# Altium schematic sheet MainSchematic.SchDoc
size A; SheetNumber: 1; SheetTotal: 1
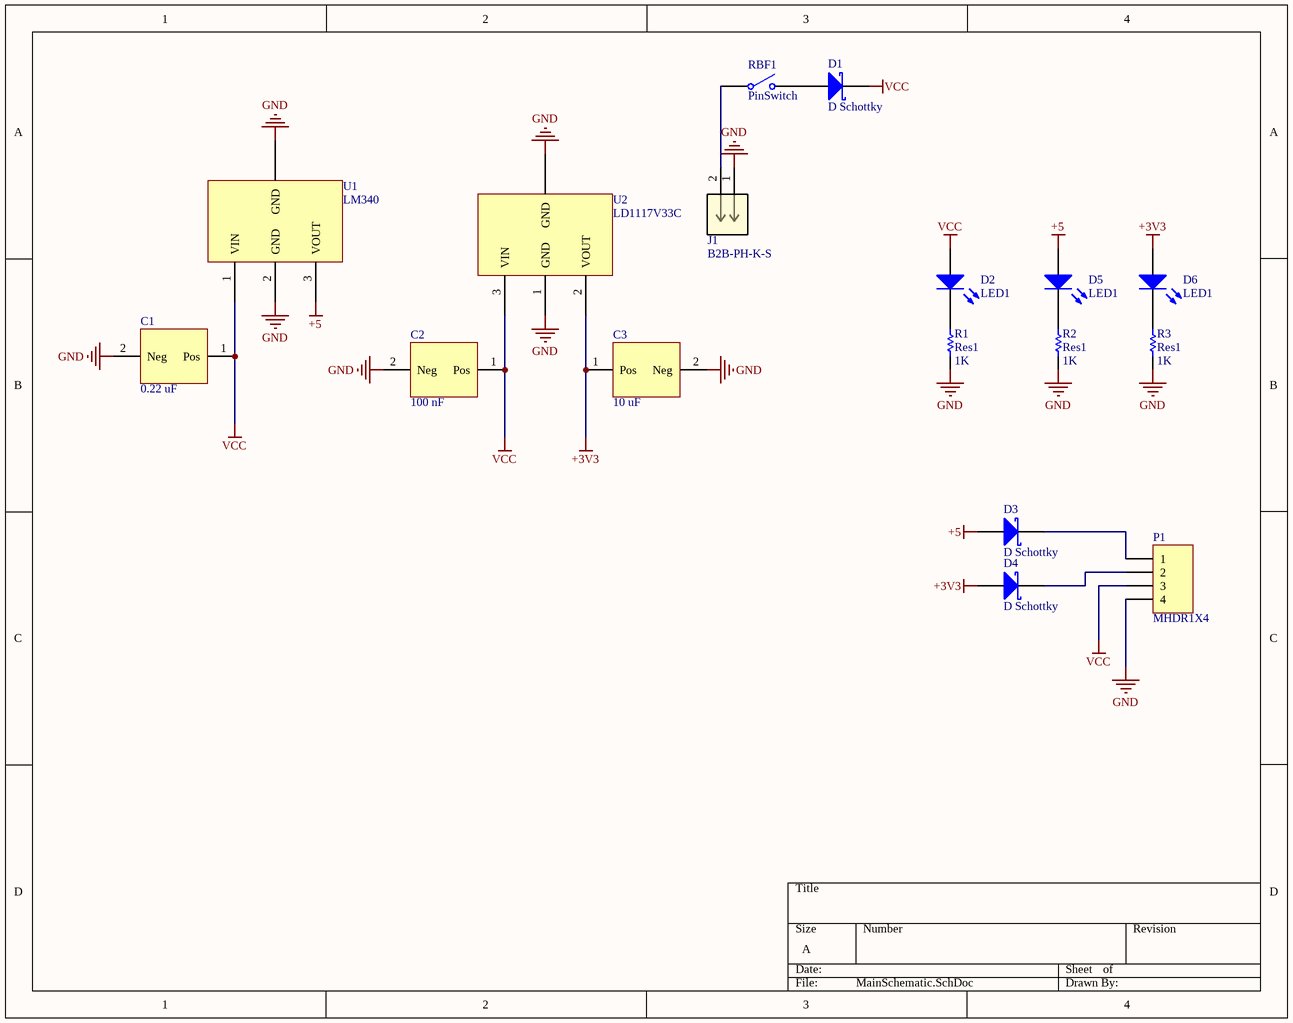
[diagram p0: MainSchematic.SchDoc]

## Parts
C1  0.22 uF  [C1206]
C2  100 nF  [C1206]
C3  10 uF  [C1206]
D1  D Schottky  [SMB]
D2  LED1  [LED-1]
D3  D Schottky  [SMB]
D4  D Schottky  [SMB]
D5  LED1  [LED-1]
D6  LED1  [LED-1]
J1  B2B-PH-K-S  [CONN2_B2B-PH-K-S_JST]
P1  MHDR1X4  [MHDR1X4]
R1  Res1  value 1K  [AXIAL-0.3]
R2  Res1  value 1K  [AXIAL-0.3]
R3  Res1  value 1K  [AXIAL-0.3]
RBF1  PinSwitch  [SwitchPin]
U1  LM340  [TO-220AB]
U2  LD1117V33C  [TO-220AB]

## Nets
+3V3: C3.1(Pos) D4.1(A) D6.1(A) U2.2(VOUT)
+5: D3.1(A) D5.1(A) U1.3(VOUT)
GND: C1.2(Neg) C2.2(Neg) C3.2(Neg) J1.1 P1.4 R1.1 R2.1 R3.1 U1.2(GND) U1.?1(GND) U2.1(GND) U2.?1(GND)
VCC: C1.1(Pos) C2.1(Pos) D1.2(K) D2.1(A) P1.3 U1.1(VIN) U2.3(VIN)
NetD1_1: D1.1(A) RBF1.1(NO)
NetD2_2: D2.2(K) R1.2
NetD3_2: D3.2(K) P1.1
NetD4_2: D4.2(K) P1.2
NetD5_2: D5.2(K) R2.2
NetD6_2: D6.2(K) R3.2
NetJ1_2: J1.2 RBF1.0(COMMON)

## Library data of the parts
C1-C3 = Electrolytic Capacitor: Filter Capacitor
D1 D3 D4 = D Schottky: Schottky Diode; Published: 8-Jun-2000; LatestRevisionDate: 17-Jul-2002; LatestRevisionNote: Re-released for DXP Platform.; PackageReference: SMB; Publisher: Altium Limited; PackageDescription: DO-214-AA/SMB; 2 C-Bend Leads; Body 5.3 x 3.6 mm, inc. leads (LxW); Code_JEDEC: DO-214-AA
D2 D5 D6 = LED1: Typical RED GaAs LED; Published: 8-Jun-2000; LatestRevisionDate: 08-Jul-2005; LatestRevisionNote: Mech Layer 1 removed.; PackageReference: LED-1; Publisher: Altium Limited; PackageDescription: LED; 2 Leads
J1 = B2B-PH-K-S: No Description Available; Mfr_Name: JST; RefDes: RefDes; Type: Type
P1 = MHDR1X4: Header, 4-Pin; LatestRevisionDate: 17-Jul-2002; LatestRevisionNote: Re-released for DXP Platform.; Publisher: Altium Limited
R1-R3 = Res1: Resistor; Published: 8-Jun-2000; LatestRevisionDate: 17-Jul-2002; LatestRevisionNote: Re-released for DXP Platform.; PackageReference: AXIAL-0.3; Publisher: Altium Limited; PackageDescription: Axial Device, Thru-Hole; 2 Leads; 0.3 in Pin Spacing
RBF1 = PinSwitch: RBF pin for turning on/off payload
U1 = LDO 5V: LM340 LDO 5V Out
U2 = LDO 3V3: STM LD1117V33C LDO. Different pinout from 5V LDO